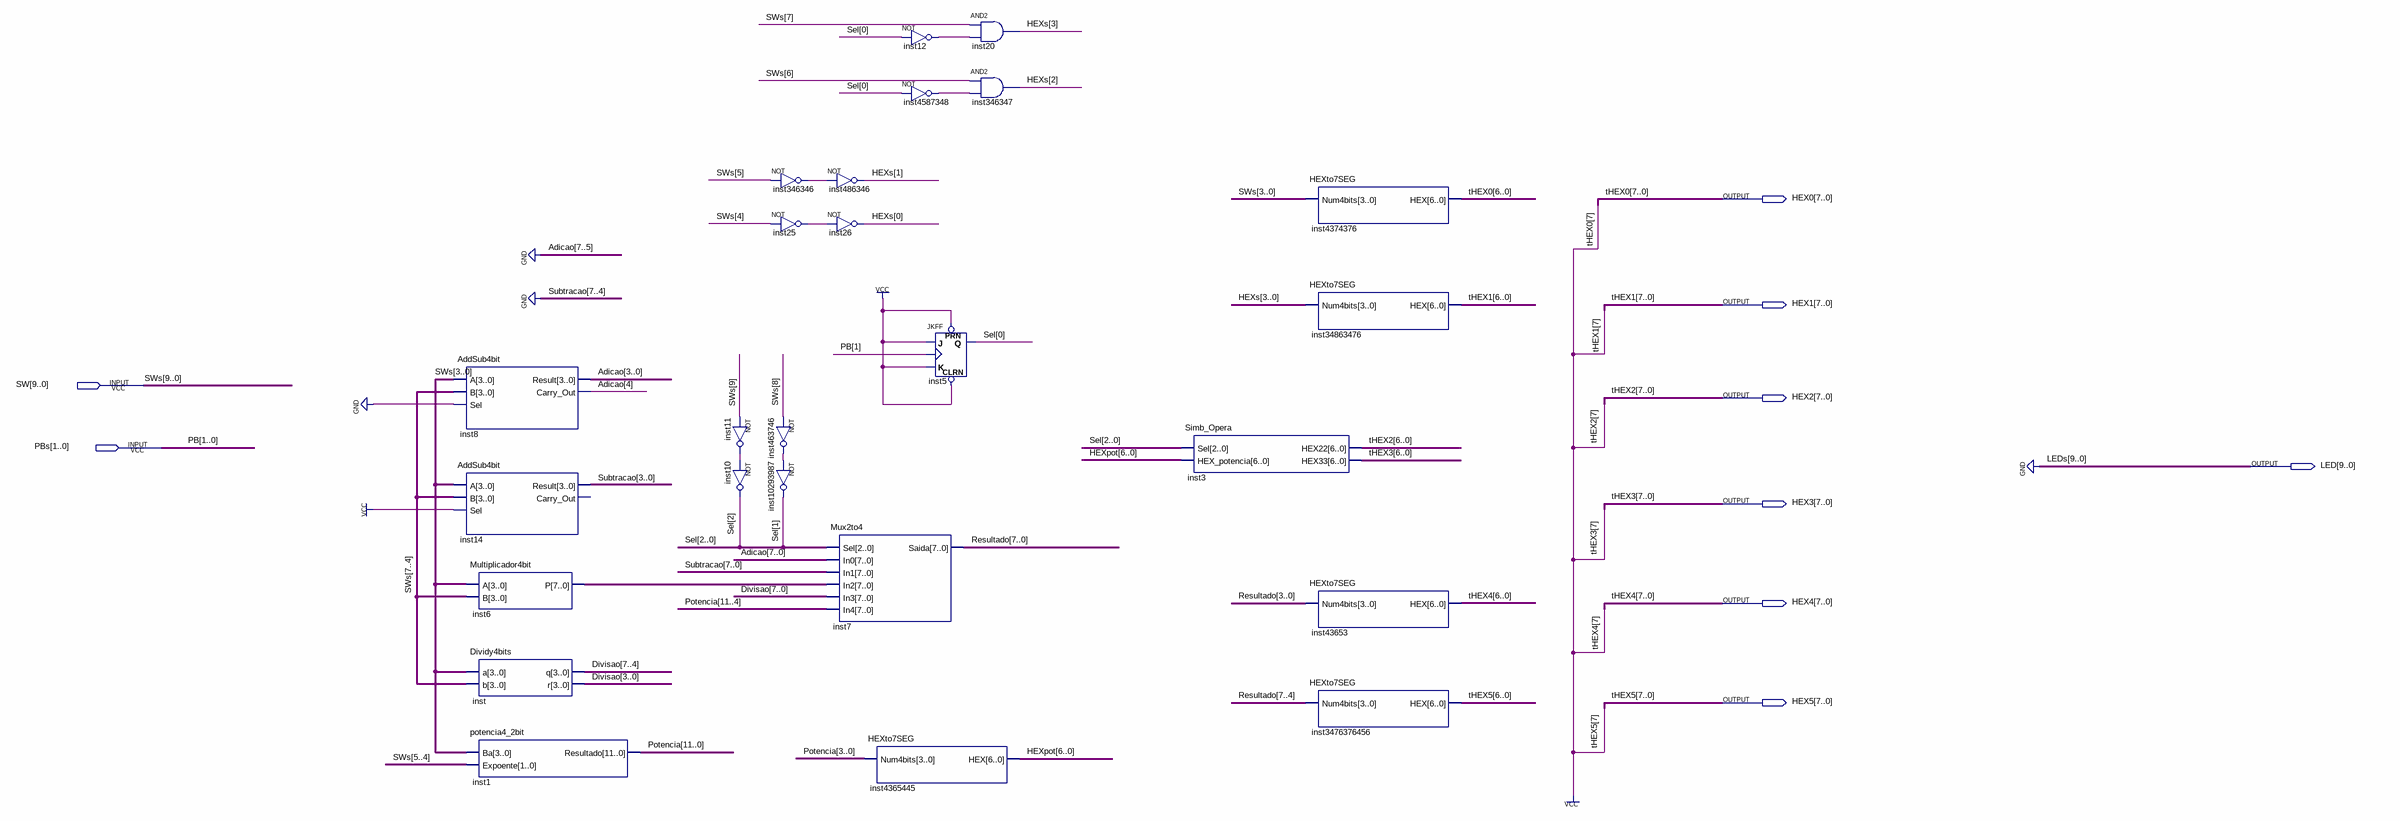
[diagram p0: schematic sheet]
// Quartus schematic Calculadora_Bin_Hex.bdf as structural Verilog: 25 symbols, 9 pins
module Calculadora_Bin_Hex (
  input  [9:0] SW,
  input  [1:0] PBs,
  output [7:0] HEX0,
  output [7:0] HEX1,
  output [7:0] HEX2,
  output [9:0] LED,
  output [7:0] HEX3,
  output [7:0] HEX4,
  output [7:0] HEX5
);

  wire inst11_out, inst12_out, inst25_out, inst346346_out, inst463746_out, inst4587348_out;
  wire [2:0] Sel;
  wire [3:0] HEXs, Subtracao;
  wire [4:0] Adicao;
  wire [6:0] HEXpot;
  wire [7:0] Divisao, inst6_p, Resultado;
  wire [11:0] Potencia;

  AddSub4bit inst8 (.A(SW[3:0]), .B(SW[7:4]), .Sel(1'b0), .Result(Adicao[3:0]), .Carry_Out(Adicao[4]));
  AddSub4bit inst14 (.A(SW[3:0]), .B(SW[7:4]), .Sel(1'b1), .Result(Subtracao));  // open: Carry_Out
  Multiplicador4bit inst6 (.A(SW[3:0]), .B(SW[7:4]), .P(inst6_p));
  Dividy4bits inst (.a(SW[3:0]), .b(SW[7:4]), .q(Divisao[7:4]), .r(Divisao[3:0]));
  potencia4_2bit inst1 (.Ba(SW[3:0]), .Expoente(SW[5:4]), .Resultado(Potencia));
  not inst11 (inst11_out, SW[9]);
  not inst10 (Sel[2], inst11_out);
  not inst346346 (inst346346_out, SW[5]);
  not inst25 (inst25_out, SW[4]);
  not inst463746 (inst463746_out, SW[8]);
  not inst10293987 (Sel[1], inst463746_out);
  not inst486346 (HEXs[1], inst346346_out);
  not inst26 (HEXs[0], inst25_out);
  Mux2to4 inst7 (
    .Sel(Sel), .In0({3'b000, Adicao}), .In1({4'b0000, Subtracao}), .In2(inst6_p), .In3(Divisao),
    .In4(Potencia[11:4]), .Saida(Resultado));
  HEXto7SEG inst4365445 (.Num4bits(Potencia[3:0]), .HEX(HEXpot));
  not inst12 (inst12_out, Sel[0]);
  not inst4587348 (inst4587348_out, Sel[0]);
  JKFF inst5 (.PRN(1'b1), .CLRN(1'b1), .K(1'b1), .J(1'b1), .CLK(PBs[1]), .Q(Sel[0]));
  and inst20 (HEXs[3], SW[7], inst12_out);
  and inst346347 (HEXs[2], SW[6], inst4587348_out);
  Simb_Opera inst3 (.Sel(Sel), .HEX_potencia(HEXpot), .HEX22(HEX2[6:0]), .HEX33(HEX3[6:0]));
  HEXto7SEG inst4374376 (.Num4bits(SW[3:0]), .HEX(HEX0[6:0]));
  HEXto7SEG inst34863476 (.Num4bits(HEXs), .HEX(HEX1[6:0]));
  HEXto7SEG inst43653 (.Num4bits(Resultado[3:0]), .HEX(HEX4[6:0]));
  HEXto7SEG inst3476376456 (.Num4bits(Resultado[7:4]), .HEX(HEX5[6:0]));

  assign HEX0[7] = 1'b1;
  assign HEX1[7] = 1'b1;
  assign HEX2[7] = 1'b1;
  assign HEX3[7] = 1'b1;
  assign HEX4[7] = 1'b1;
  assign HEX5[7] = 1'b1;
  assign LED = {10{1'b0}};

  // Other names for the same wires on the sheet: PB[1:0] = PBs; SWs[9:0] = SW; tHEX0[6:0] = HEX0[6:0];
  //   tHEX1[6:0] = HEX1[6:0]; tHEX2[6:0] = HEX2[6:0]; tHEX3[6:0] = HEX3[6:0]; tHEX4[6:0] = HEX4[6:0];
  //   tHEX5[6:0] = HEX5[6:0]
endmodule
